# Altium schematic sheet BTL_mach_nap_acquy_12v_chia_khoi.SchDoc
size A; SheetNumber: 1; SheetTotal: 1
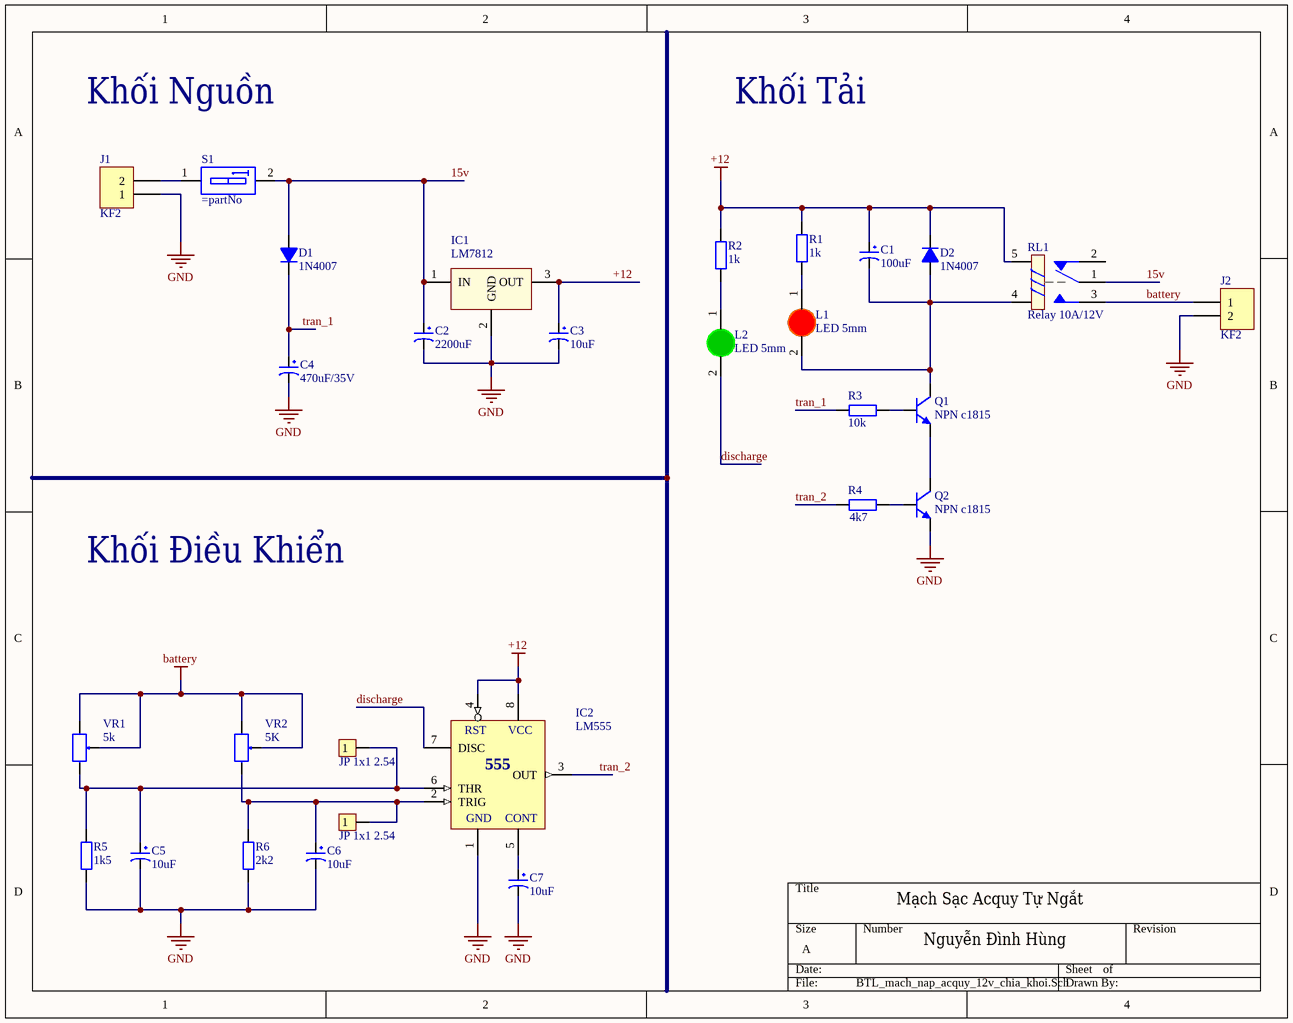
[diagram p0: BTL_mach_nap_acquy_12v_chia_khoi.SchDoc]

## Parts
C1  100uF  [tu hoa 5mm]
C2  2200uF  [tu hoa 13mm]
C3  10uF  [CP1/2]
C4  470uF/35V  [CP1.5/3.4]
C5  10uF  [CP1/2]
C6  10uF  [CP1/2]
C7  10uF  [CP1/2]
D1  1N4007  [D1A]
D2  1N4007  [D1A]
IC1  LM7812  [QTO-220H3]
IC2  LM555  [DIP8]
J1  KF2  [KF2-3.5]
J2  KF2  [KF2-3.5]
JP1  JP 1x1 2.54  [JP 1x1 DT]
JP2  JP 1x1 2.54  [JP 1x1 DT]
L1  LED 5mm  [LED-5MM-RED]
L2  LED 5mm  [LED-5MM-Green]
Q1  NPN c1815  [TRAN-LOWPOWER]
Q2  NPN c1815  [TRAN-LOWPOWER]
R1  1k  [R1/4W]
R2  1k  [R1/4W]
R3  10k  [R1/4W]
R4  4k7  [R1/4W]
R5  1k5  [R1/4W]
R6  2k2  [R1/4W]
RL1  Relay 10A/12V  [RELAY 5]
S1  (no value)  [SW-DIP1]
VR1  5k  [VR1]
VR2  5K  [VR1]

## Nets
+12: C1.1 C3.1 D2.2(K) IC1.3(OUT) IC2.4(RST) IC2.8(VCC) R1.2 R2.2 RL1.5
battery: J2.1 RL1.3 VR1.1 VR1.2 VR2.1 VR2.2
GND: C2.2 C3.2 C4.2 C5.2 C6.2 C7.2 IC1.2(GND) IC2.1(GND) J1.1 J2.2 Q2.1(E) R5.1 R6.1
15v: C2.1 D1.1(A) IC1.1(IN) RL1.1 S1.2
discharge: IC2.7(DISC) L2.2(K)
tran_1: C4.1 D1.2(K) R3.2
tran_2: IC2.3(OUT) R4.2
NetC1_2: C1.2 D2.1(A) L1.2(K) Q1.2(C) RL1.4
NetC5_1: C5.1 IC2.6(THR) JP1.1 R5.2 VR1.3
NetC6_1: C6.1 IC2.2(TRIG) JP2.1 R6.2 VR2.3
NetC7_1: C7.1 IC2.5(CONT)
NetJ1_2: J1.2 S1.1
NetL1_1: L1.1(A) R1.1
NetL2_1: L2.1(A) R2.1
NetQ1_1: Q1.1(E) Q2.2(C)
NetQ1_3: Q1.3(B) R3.1
NetQ2_3: Q2.3(B) R4.1

Not connected (* = marked no-connect by the designer): RL1 2

## Notes on the sheet
- Khối Nguồn
- Khối Tải
- Khối Điều Khiển
- Mạch Sạc Acquy Tự Ngắt
- Nguyễn Đình Hùng
- (in symbol LM555) 555

## Library data of the parts
C1 = Tu Hoa 100uF 25V 6x11: Cắm; Don_Vi: Con; So_Chan: 2; Ten_Linh_Kien: Tụ Hóa 100uF 25V 6x11MM; Ma_Hang: MH001351; Chung_Loai: Cắm; Kieu_Chan: *
C2 = Tu Hoa 2200uF 25V 13x20: Cắm; So_Chan: 2; Don_Vi: Con; Ten_Linh_Kien: Tụ Hóa 2200uF 25V 13x20MM; Ma_Hang: MH002203; Chung_Loai: Cắm; Kieu_Chan: *
C3 C5-C7 = CP1: Cap P  0,1uF < 22uF , 16 - 50V; Value: 10uF/50V; Description 1: 10 => 220uF/6,3V/10V - 10uF => 100uF/16V; Description 2: 0,1uF => 33uF/50V - 10uF => 22uF/63V; Description 3: 0,47uF => 10uF/100V
C4 = CP3: Cap 100uF/35V - 470uF/16V; Value: 100uF/35V/50V; Description 1: 1000uF/6,3V - 470uF/16V - 330uF - 25V; Description 2: 220uF/35V - 100uF/50V - 63V - 4,7uF/200V; Description 3: 22uF => 33uF100V - 3,3uF => 4,7uF/250V; Description 4: 2,2uF =>3,3uF/350 - 2,2uF/400V - 1uF/450V
D1 D2 = Diode 1A: Value: 1N4007
IC1 = LM78xx: On ap +, from + 5 to + 24VDC; Value: LM7805
IC2 = LM555: Timer Circuits; Value: LM555
J1 J2 = KF2: Manufacturer: Würth Elektronik eiSos GmbH; partNo: 691103110002; ComponentLink1 Description: Manufacturer; ComponentLink2 Description: Datasheet; NoPins: 2; Created Date: 29 October 2013; ComponentLink1URL: http://www.we-online.com; ComponentLink2URL: http://katalog.we-online.de/em/datasheet/6911031100xx.pdf; Created by: Karrer Zheng
JP1 JP2 = JP 1x1 2.54 Duc Cong: Cắm; Ten_Linh_Kien: Jump Đơn Đực 2.54MM 1x40P Cong Đứng; Don_Vi: Con; Ma_Hang: MH000904; Ghi_Chu: *; Kieu_Chan: *; Chung_Loai: Cắm
L1 = LED 5mm Do: Cắm; Don_Vi: Con; Ma_Hang: MH008967; Ten_Linh_Kien: Led 5MM Phủ Đỏ (1000c); Ghi_Chu: *; Kieu_Chan: *; Chung_Loai: Cắm
L2 = LED 5mm Xanh La: Cắm; Don_Vi: Con; Ma_Hang: MH008969; Ten_Linh_Kien: LED 5MM Phủ Xanh (1000c); Ghi_Chu: *; Kieu_Chan: *; Chung_Loai: Cắm
Q1 Q2 = NPN: NPN General; Published: 8-Jun-2000; LatestRevisionDate: 15-Jan-2003; LatestRevisionNote: PCB Footprint 'BCY-W3/D4.7' replaced; DatasheetDocument: 1997; PackageDocument: Sep-1998; PackageReference: TO-92A; Publisher: Altium Limited; Code_JEDEC: TO-92A; ComponentLink1Description: Manufacturer Link; ComponentLink1URL: http://www.fairchildsemi.com/; ComponentLink2Description: Datasheet; ComponentLink2URL: http://www.fairchildsemi.com/ds/2N%2F2N3904.pdf
R1-R6 = R1/4W: Resistor 1/4W; Value: R1/4W - 1K
RL1 = Relay 5: Relay SPDT,10A - 12VDC 5 Pin; Value: Relay SPDT, 10A, 12V
S1 = SWDIP1: WS-DITV 2.54 mm small compact THT flat actuator with top tape; Manufacturer: Wurth Elektronik; Part No.: 418127160901; ComponentLink1 Description: Manufacturer; ComponentLink2 Description: Datasheet; Pole: 01; Created Date: Dec.2015; ComponentLink1URL: http://www.we-online.com; ComponentLink2URL: http://katalog.we-online.de/em/datasheet/4181271609xx.pdf; Created by: Baojun Chen
VR1 VR2 = VR: Var Resistor; Value: VR 10K